# Altium schematic sheet RAIL_DISCHARGE.SchDoc
size A4; SheetNumber: 19; SheetTotal: 19
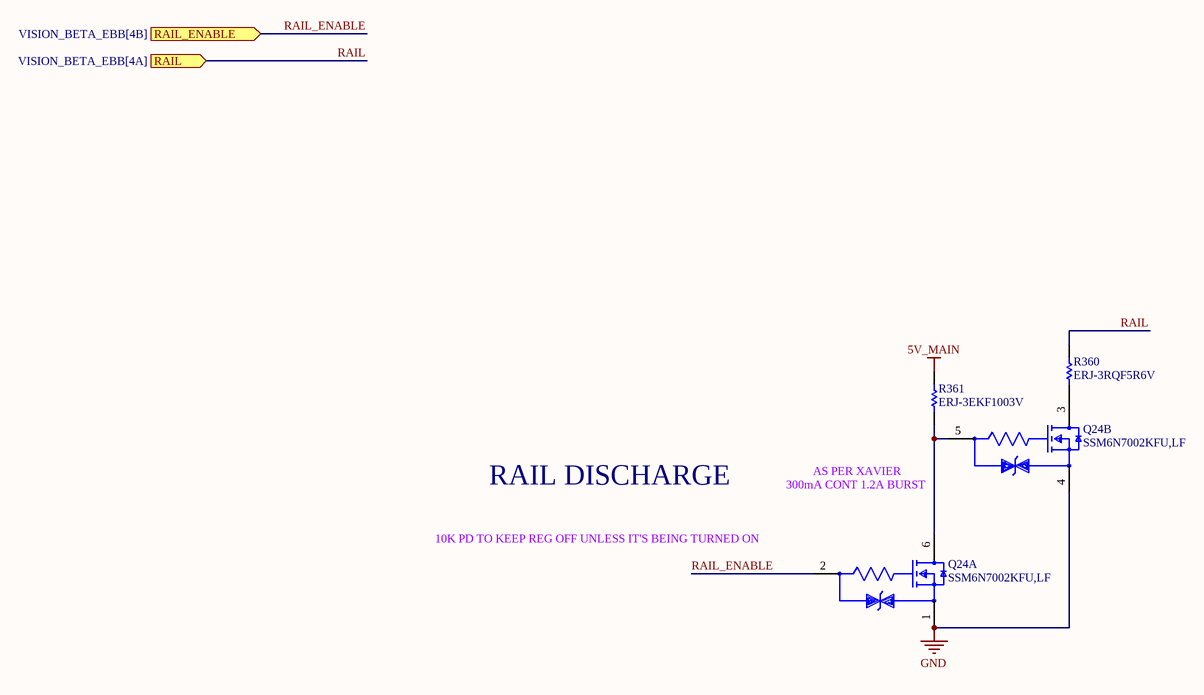
[diagram p0: RAIL_DISCHARGE.SchDoc]

## Parts
Q24  SSM6N7002KFU,LF  [FP-SSOP6-P-0_65A-MFG]  (parts A,B of 2)
R360  ERJ-3RQF5R6V  [RESC1608X55X30LL15T15]
R361  ERJ-3EKF1003V  [RESC1608X55X30ML15T15]

## Ports
RAIL (in, see VISION_BETA_EBB[4A]), RAIL_ENABLE (in, see VISION_BETA_EBB[4B])

## Nets
5V_MAIN: R361.2
GND: Q24.1(Source1) Q24.4(Source2)
RAIL: R360.2 ; port RAIL
RAIL_ENABLE: Q24.2(Gate1) ; port RAIL_ENABLE
NetQ24_3: Q24.3(Drain2) R360.1
NetQ24_5: Q24.5(Gate2) Q24.6(Drain1) R361.1

## Notes on the sheet
- RAIL DISCHARGE
- 300mA CONT 1.2A BURST
- AS PER XAVIER
- 10K PD TO KEEP REG OFF UNLESS IT'S BEING TURNED ON

## Library data of the parts
Q24 = CMP-35916-000009-1: MOSFET 2N-CH 60V 0.3A; Input Capacitance: 40pF; Continuous Drain Current (ID): 300mA; Max Power Dissipation: 285mW; FET Type: 2 N-Channel; Rds On Max: 1.5R; Mount: Surface Mount; Drain to Source Voltage (Vdss): 60V; Packaging: Tape and Reel
R360 = CMP-2000-00850-1: Manufacturer: Panasonic; Part Number: ERJ-3RQF5R6V
R361 = CMP-2000-00182-1: Manufacturer: Panasonic; Part Number: ERJ-3EKF1003V